# Altium schematic sheet rpi-ckt.SchDoc
size A4; SheetNumber: 5; SheetTotal: 5
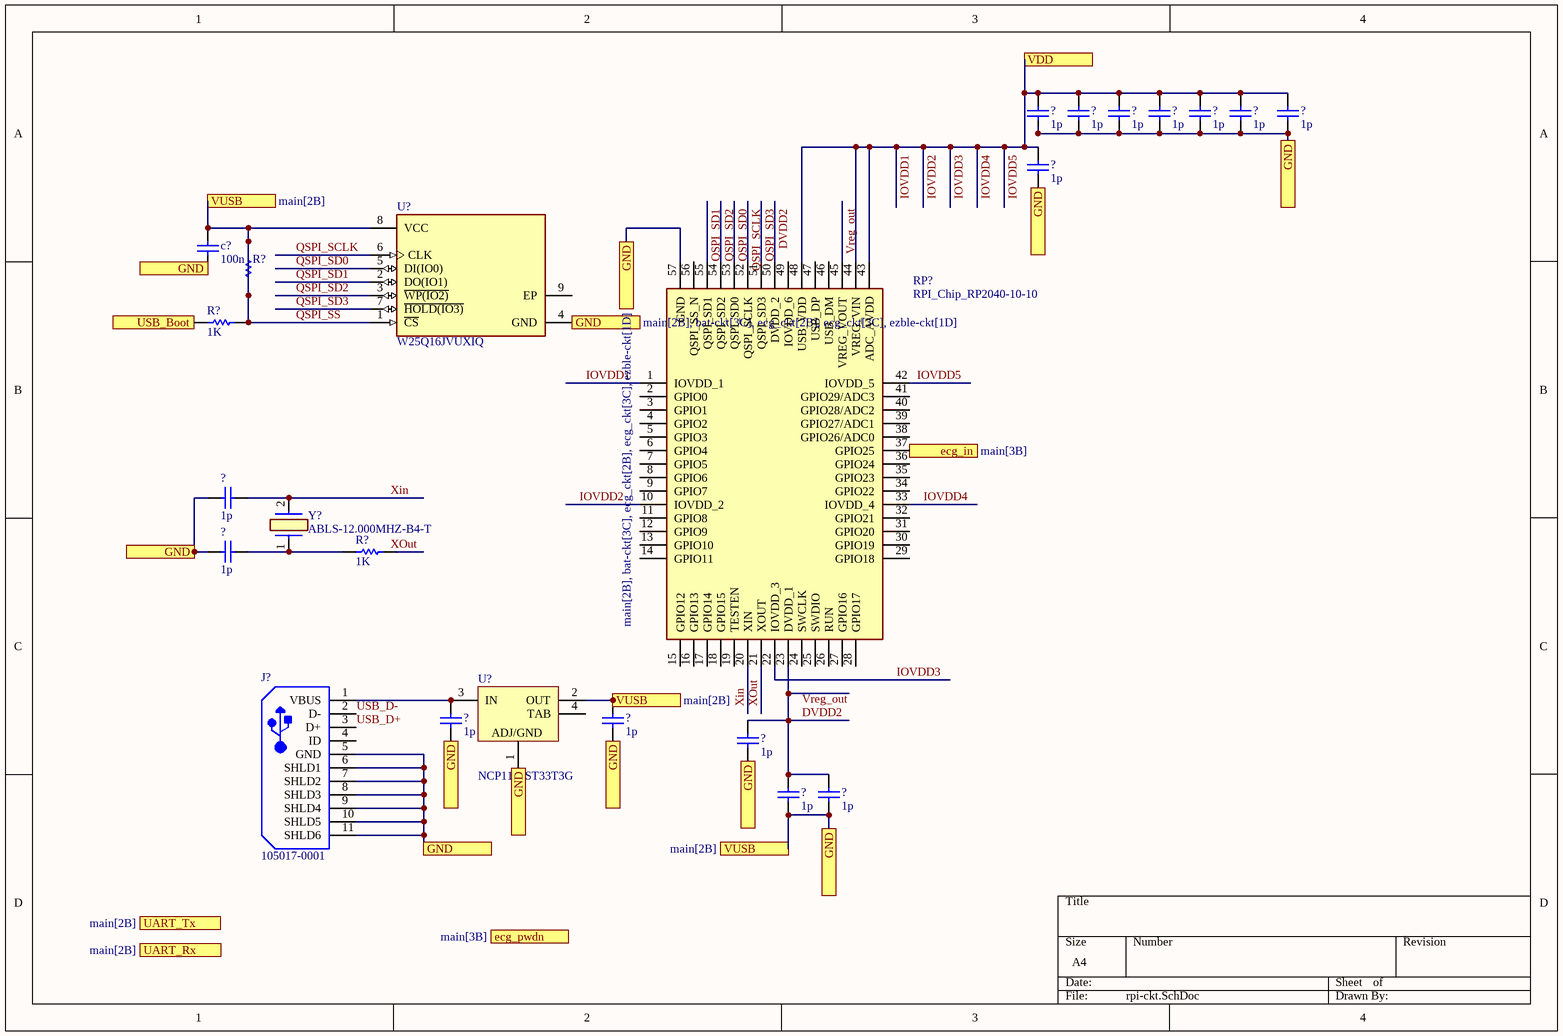
[diagram p0: rpi-ckt.SchDoc]

## Parts
(Parts that share a designator on the sheet are numbered #1, #2 ... from top to bottom, then left to right.)
?#1  value 1p  (hidden comment: Capacitor)
?#2  value 1p  (hidden comment: Capacitor)
?#3  value 1p  (hidden comment: Capacitor)
?#4  value 1p  (hidden comment: Capacitor)
?#5  value 1p  (hidden comment: Capacitor)
?#6  value 1p  (hidden comment: Capacitor)
?#7  value 1p  (hidden comment: Capacitor)
?#8  value 1p  (hidden comment: Capacitor)
?#9  value 1p  (hidden comment: Capacitor)
?#10  value 1p  (hidden comment: Capacitor)
?#11  value 1p  (hidden comment: Capacitor)
?#12  value 1p  (hidden comment: Capacitor)
?#13  value 1p  (hidden comment: Capacitor)
?#14  value 1p  (hidden comment: Capacitor)
?#15  value 1p  (hidden comment: Capacitor)
c?  value 100n  (hidden comment: Capacitor)
J?  105017-0001  [USB-MICRO-B_V]
R?#1  Resistor  (value not drawn)
R?#2  value 1K  (hidden comment: Resistor)
R?#3  value 1K  (hidden comment: Resistor)
RP?  RPI_Chip_RP2040-10-10  [QFN40P700X700X90-57N-D]
U?#1  W25Q16JVUXIQ  [FP-UX-MFG]
U?#2  NCP1117ST33T3G  [ONSC-SOT-223-4-318H-01_A_V]
Y?  ABLS-12.000MHZ-B4-T  [ABLS]

## Ports
ecg_in (see main[3B]), ecg_pwdn (see main[3B]), GND, GND (see main[2B], bat-ckt[3C], ecg_ckt[2B], ecg_ckt[3C], ezble-ckt[1D]), UART_Rx (see main[2B]), UART_Tx (see main[2B]), USB_Boot, VDD, VUSB (see main[2B])

## Nets
DVDD2: ?#13.2 ?#14.1 ?#15.2 RP?.23(DVDD_1) RP?.50(DVDD_2)
ecg_in: RP?.37(GPIO25) ; port ecg_in
IOVDD1: ?#1.2 ?#2.2 ?#3.2 ?#4.2 ?#5.2 ?#6.2 ?#7.2 ?#8.2 RP?.1(IOVDD_1) RP?.10(IOVDD_2) RP?.22(IOVDD_3) RP?.33(IOVDD_4) RP?.42(IOVDD_5) RP?.43(ADC_AVDD) RP?.44(VREG_VIN) RP?.48(USB_VDD) ; port VDD  [also labelled IOVDD2, IOVDD3, IOVDD4, IOVDD5]
QSPI_SCLK: RP?.52(QSPI_SCLK) U?#1.6(CLK)
QSPI_SD0: RP?.53(QSPI_SD0) U?#1.5(DI(IO0))
QSPI_SD1: RP?.55(QSPI_SD1) U?#1.2(DO(IO1))
QSPI_SD2: RP?.54(QSPI_SD2) U?#1.3(~{WP(IO2)})
QSPI_SD3: RP?.51(QSPI_SD3) U?#1.7(~{HOLD(IO3)})
QSPI_SS: ?#1.1 ?#2.1 ?#3.1 ?#4.1 ?#5.1 ?#6.1 ?#7.1 ?#8.1 ?#9.1 ?#10.1 ?#11.1 ?#12.1 ?#12.2 ?#13.1 ?#14.2 ?#15.1 c?.1 c?.2 J?.5(GND) J?.6(SHLD1) J?.7(SHLD2) J?.8(SHLD3) J?.9(SHLD4) J?.10(SHLD5) J?.11(SHLD6) R?#1.1 R?#1.2 R?#2.2 RP?.57(GND) U?#1.1(~{CS}) U?#1.4(GND) U?#1.8(VCC) U?#2.1(ADJ/GND) U?#2.2(OUT) ; port VUSB, port GND
USB_Boot: R?#2.1 ; port USB_Boot
USB_D+: J?.3(D+)
USB_D-: J?.2(D-)
Vreg_out: RP?.45(VREG_VOUT)
Xin: ?#9.2 RP?.20(XIN) Y?.2
XOut: RP?.21(XOUT)
Net?#10_2: ?#10.2 R?#3.1 Y?.1
Net?#11_2: ?#11.2 J?.1(VBUS) U?#2.3(IN)

Not connected (* = marked no-connect by the designer): J? 4(ID); R?#3 2; RP? 2(GPIO0) 3(GPIO1) 4(GPIO2) 5(GPIO3) 6(GPIO4) 7(GPIO5) 8(GPIO6) 9(GPIO7) 11(GPIO8) 12(GPIO9) 13(GPIO10) 14(GPIO11) 15(GPIO12) 16(GPIO13) 17(GPIO14) 18(GPIO15) 19(TESTEN) 24(SWCLK) 25(SWDIO) 26(RUN) 27(GPIO16) 28(GPIO17) 29(GPIO18) 30(GPIO19) 31(GPIO20) 32(GPIO21) 34(GPIO22) 35(GPIO23) 36(GPIO24) 38(GPIO26/ADC0) 39(GPIO27/ADC1) 40(GPIO28/ADC2) 41(GPIO29/ADC3) 46(USB_DM) 47(USB_DP) 49(IOVDD_6) 56(QSPI_SS_N); U?#1 9(EP); U?#2 4(TAB)

## Notes on the sheet
- Labels drawn without touching a wire or pin: Vreg_out, XOut

## Library data of the parts
?#1-?#15 c? = Capacitor: SimulationGenericComponent: True
J? = CMP-2000-05827-1: Micro-USB B Receptacle, Right Angle, Bottom Mount, Surface Mount, with Solder Tabs, -30 to 85 degC, 5-Pin USB, RoHS, Tape and Reel; Manufacturer: Molex; Featured Product: Micro-USBConnectorsUSBConnectors; Other Names: WM1399DKR; Package Version: Rev. F, 12/2012; Number of Contacts: 5; Connector Type: USB-microB; Catalog Drawings: 1050170001; 3D Model: 105017-0001.stp; Mating Products: WM17145-ND-CABLEMICROUSBBTOSTDA1.0MWM17147-ND-CABLEMICROUSBBTOSTDA2.0MWM17146-ND-CABLEMICROUSBBTOSTDA1.5M; PCN Assembly/Origin: ResinSupplier21/Oct/2015; Voltage - Max: 30V; Online Catalog: Molex-MicroUSB; Manufacturer URL: http://www.molex.com/; Package Description: 5-Leads USB, Micro B, Body 7.5 x 5 mm, Pitch 0.65 mm; Datasheet URL: http://www.molex.com/elqNow/elqRedir.htm?ref=http://www.molex.com/webdocs/datasheets/pdf/en-us/1050170001_IO_CONNECTORS.pdf; Ingress Protection: -; Datasheet Version: 03/2016; Mounting Type: BoardCutout,SurfaceMount,RightAngle; Circuits: 5; Standard Package: 1; Package Reference: MICRO-B; Package URL: http://www.molex.com/pdm_docs/sd/1050170001_sd.pdf; Category: Connectors,Interconnects; Series: -; RoHS Information: 1050170001CertofCompliance; Features: Shielded,SolderRetention; Family: USB,DVI,HDMIConnectors; Specifications: -; Gender: Receptacle; Packaging: Digi-Reel®; Mounting Technology: SurfaceMount
R?#1-R?#3 = Resistor: TC1: 0; SimulationGenericComponent: True; TC2: 0
RP? = RPI_Chip_RP2040-10-10: Integrated Circuit; Manufacturer_Name: RASPBERRY-PI; Manufacturer_Part_Number: RPI Chip RP2040-10-10; Datasheet Link: https://datasheets.raspberrypi.com/rp2040/rp2040-datasheet.pdf; Height: 0.9mm; Mouser Part Number: 358-RP2040CHIP-10-10; Mouser Price/Stock: https://www.mouser.co.uk/ProductDetail/Raspberry-Pi/RPI-Chip-RP2040-10-10?qs=QNEnbhJQKva2vG4DZ5VuhA%3D%3D
U?#1 = CMP-78876-000011-1: IC FLASH 16MBIT SPI/QUAD 8USON; RoHS Compliant: Yes
U?#2 = CMP-1679-00010-1: Low-Dropout Positive Fixed Voltage Regulator, 1 A, 3.3 V Output Voltage, 0 to 125 degC, 4-Pin SOT-223 (318H-01), Pb-Free, Tape and Reel; Resistance: 220 kohm; Type (Resistor): Thick Film; Voltage Rating: 75 V; Tolerance: 1%; Case\Package: 0603; Power Rating: 100 mW; Width: 0.85 mm; Weight: 7.1E-05 oz; ComponentLink2URL: http://www.onsemi.com/pub_link/Collateral/NCP1117-D.PDF; RoHSCompliant: true; Height: 0.45 mm; PackageDescription: 4-Pin Small Outline Transistor, Body 6.5 x 3.5 mm, Pitch 2.3 mm; ComponentLink1Description: Manufacturer URL; ComponentLink1URL: http://www.onsemi.com/; PackageReference: SOT-223-4-318H-01_A; Max Operating Temperature: 155 degC; Packaging: Tape and Reel; REACH SVHC: Unknown; Length: 1.55 mm; Package Quantity: 5000; Radiation Hardening: No; Min Operating Temperature: -55 degC; DatasheetVersion: Rev. 27, 09/2014; Mount: Surface Mount; Case Code (Imperial): 0603; Case Code (Metric): 1608; ComponentLink2Description: Datasheet
Y? = ABLS-12.000MHZ-B4-T: Crystal or Oscillator; Manufacturer_Name: ABRACON; Datasheet Link: https://abracon.com/Resonators/abls.pdf; Manufacturer_Part_Number: ABLS-12.000MHZ-B4-T; Mouser Part Number: 815-ABLS-12.0M-T; Mouser Price/Stock: https://www.mouser.co.uk/ProductDetail/ABRACON/ABLS-12.000MHZ-B4-T?qs=yTU0IcKoRlGSQ8ooxPPVnQ%3D%3D; Arrow Part Number: ABLS-12.000MHZ-B4-T; Arrow Price/Stock: https://www.arrow.com/en/products/abls-12.000mhz-b4-t/abracon?region=nac